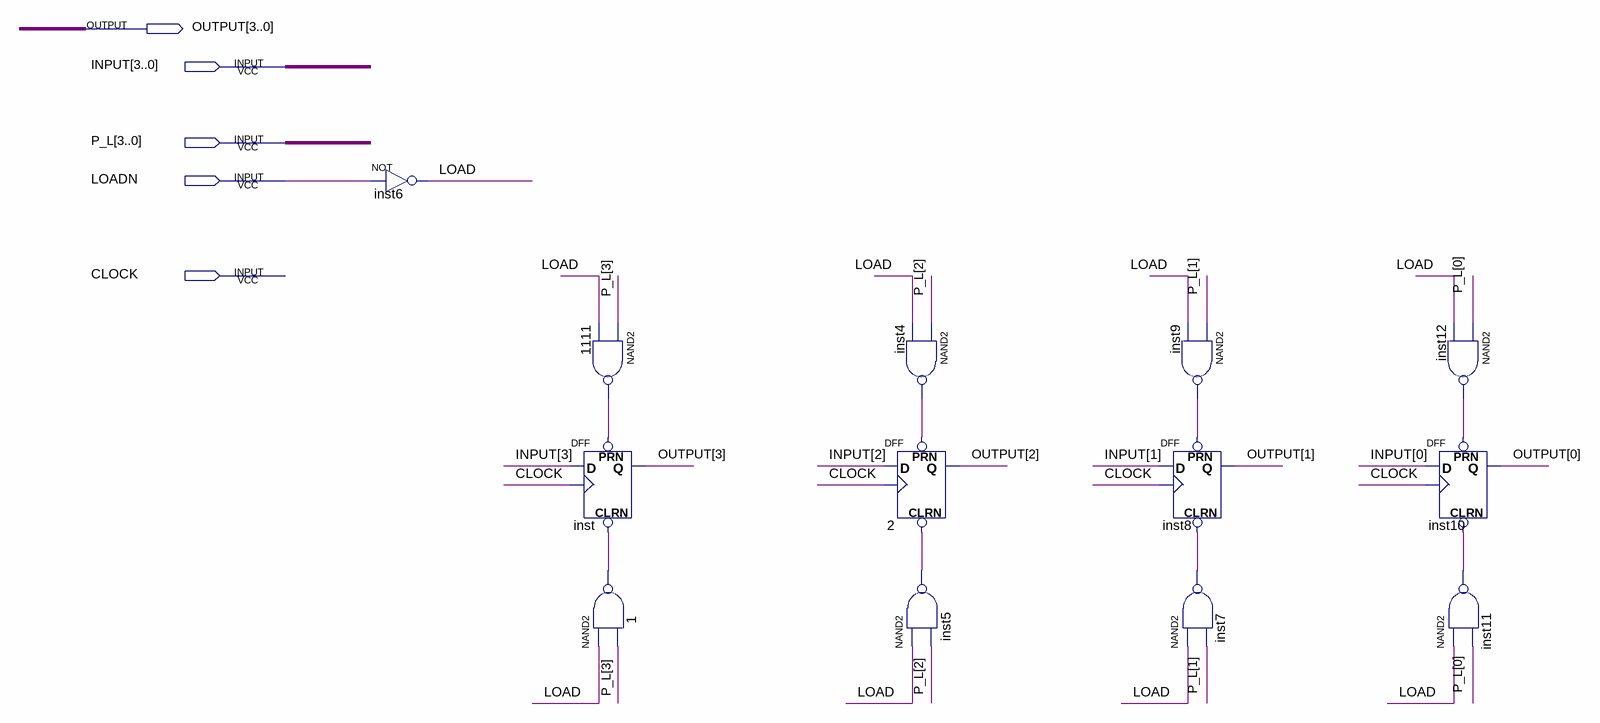
[diagram p0: schematic sheet]
// Quartus schematic REGISTER_4BIT.bdf as structural Verilog: 13 symbols, 5 pins
module REGISTER_4BIT (
  input  [3:0] INPUT,
  input  [3:0] P_L,
  input  LOADN,
  input  CLOCK,
  output [3:0] OUTPUT
);

  wire inst4_out, inst5_out, inst7_out, inst9_out, inst11_out, inst12_out, LOAD, n1_out, n1111_out;

  not inst6 (LOAD, LOADN);
  nand u_1111 (n1111_out, P_L[3], LOAD);
  DFF inst (.CLRN(n1_out), .CLK(CLOCK), .D(INPUT[3]), .PRN(n1111_out), .Q(OUTPUT[3]));
  nand u_1 (n1_out, LOAD, P_L[3]);
  nand inst4 (inst4_out, P_L[2], LOAD);
  DFF u_2 (.CLRN(inst5_out), .CLK(CLOCK), .D(INPUT[2]), .PRN(inst4_out), .Q(OUTPUT[2]));
  nand inst5 (inst5_out, LOAD, P_L[2]);
  nand inst9 (inst9_out, P_L[1], LOAD);
  DFF inst8 (.CLRN(inst7_out), .CLK(CLOCK), .D(INPUT[1]), .PRN(inst9_out), .Q(OUTPUT[1]));
  nand inst7 (inst7_out, LOAD, P_L[1]);
  nand inst12 (inst12_out, P_L[0], LOAD);
  DFF inst10 (.CLRN(inst11_out), .CLK(CLOCK), .D(INPUT[0]), .PRN(inst12_out), .Q(OUTPUT[0]));
  nand inst11 (inst11_out, LOAD, P_L[0]);
endmodule
